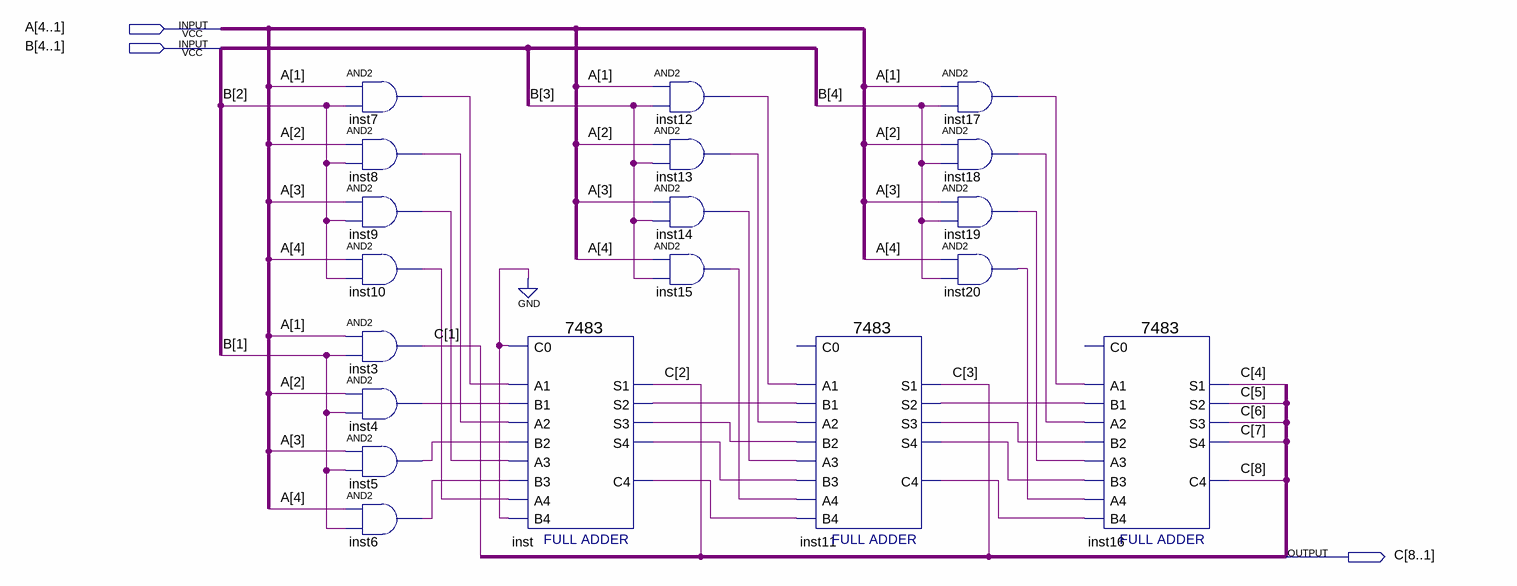
[diagram p0: schematic sheet]
// Quartus schematic mul1_sch.bdf as structural Verilog: 19 symbols, 3 pins
module mul1_sch (
  input  [4:1] A,
  input  [4:1] B,
  output [8:1] C
);

  wire inst4_out, inst5_out, inst6_out, inst7_out, inst8_out, inst9_out, inst10_out, inst11_c4, inst11_s2,
       inst11_s3, inst11_s4, inst12_out, inst13_out, inst14_out, inst15_out, inst17_out, inst18_out,
       inst19_out, inst20_out, inst_c4, inst_s2, inst_s3, inst_s4;

  and inst7 (inst7_out, A[1], B[2]);
  and inst8 (inst8_out, A[2], B[2]);
  and inst9 (inst9_out, A[3], B[2]);
  and inst10 (inst10_out, A[4], B[2]);
  and inst3 (C[1], A[1], B[1]);
  and inst4 (inst4_out, A[2], B[1]);
  and inst5 (inst5_out, A[3], B[1]);
  and inst6 (inst6_out, A[4], B[1]);
  \7483  inst (
    .B4(1'b0), .C0(1'b0), .A1(inst7_out), .A2(inst8_out), .B1(inst4_out), .B2(inst5_out), .A3(inst9_out),
    .B3(inst6_out), .A4(inst10_out), .S3(inst_s3), .S4(inst_s4), .S2(inst_s2), .C4(inst_c4), .S1(C[2]));
  and inst12 (inst12_out, A[1], B[3]);
  and inst13 (inst13_out, A[2], B[3]);
  and inst14 (inst14_out, A[3], B[3]);
  and inst15 (inst15_out, A[4], B[3]);
  \7483  inst11 (
    .B4(inst_c4), .A1(inst12_out), .A2(inst13_out), .B1(inst_s2), .B2(inst_s3), .A3(inst14_out),
    .B3(inst_s4), .A4(inst15_out), .S3(inst11_s3), .S4(inst11_s4), .S2(inst11_s2), .C4(inst11_c4), .S1(C[3]));  // open: C0
  and inst17 (inst17_out, A[1], B[4]);
  and inst18 (inst18_out, A[2], B[4]);
  and inst19 (inst19_out, A[3], B[4]);
  and inst20 (inst20_out, A[4], B[4]);
  \7483  inst16 (
    .B4(inst11_c4), .A1(inst17_out), .A2(inst18_out), .B1(inst11_s2), .B2(inst11_s3), .A3(inst19_out),
    .B3(inst11_s4), .A4(inst20_out), .S3(C[6]), .S4(C[7]), .S2(C[5]), .C4(C[8]), .S1(C[4]));  // open: C0
endmodule
